# Altium schematic sheet Power.SchDoc: Multiplekser interfejsu SWD
size A4; Organization: Altium Limited; Address1: L3, 12a Rodborough Rd; Adress2: Frenchs Forest; Address3: NSW; Address4: Australia 2086; SheetNumber: 5
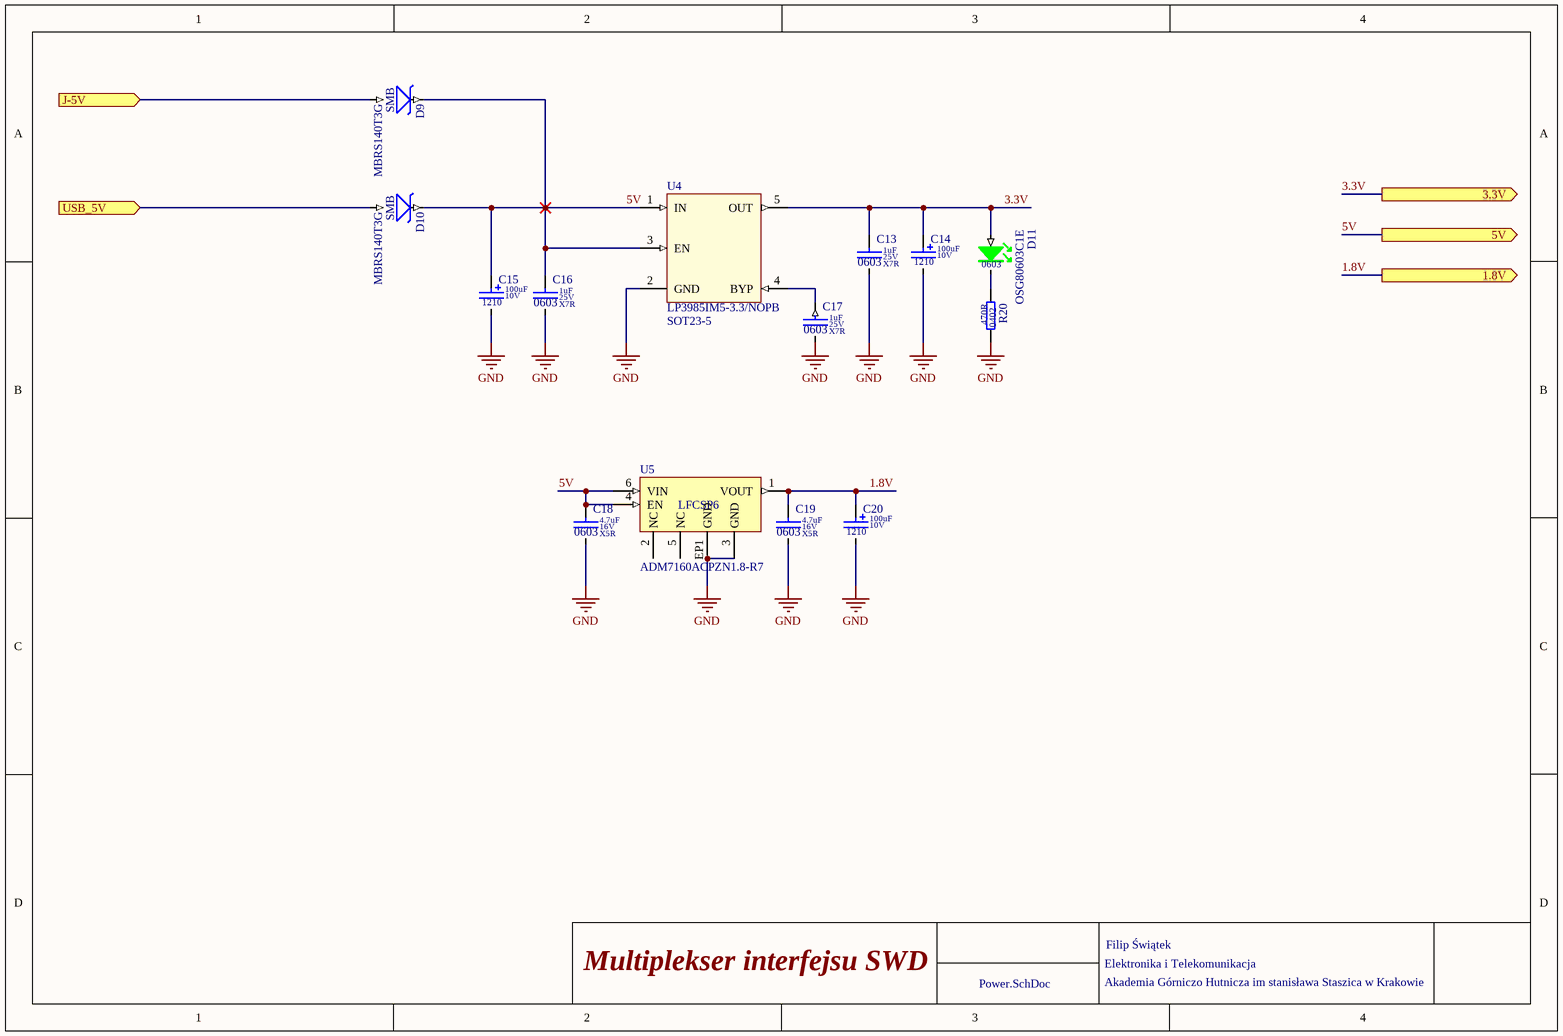
[diagram p0: Power.SchDoc]

## Parts
C13  value 1uF  Dielectric: X7R  Voltage: 25V  SCH_Footprint: 0603  [C_0603_1608]  (hidden comment: Ceramic X7R)
C14  value 100uF  SCH_Footprint: 1210  Voltage: 10V  [CT_1210_3225]  (hidden comment: Tantalum Capacitor)
C15  value 100uF  SCH_Footprint: 1210  Voltage: 10V  [CT_1210_3225]  (hidden comment: Tantalum Capacitor)
C16  value 1uF  Dielectric: X7R  Voltage: 25V  SCH_Footprint: 0603  [C_0603_1608]  (hidden comment: Ceramic X7R)
C17  value 1uF  Dielectric: X7R  Voltage: 25V  SCH_Footprint: 0603  [C_0603_1608]  (hidden comment: Ceramic X7R)
C18  value 4.7uF  Dielectric: X5R  Voltage: 16V  SCH_Footprint: 0603  [C_0603_1608]  (hidden comment: Ceramic X5R)
C19  value 4.7uF  Dielectric: X5R  Voltage: 16V  SCH_Footprint: 0603  [C_0603_1608]  (hidden comment: Ceramic X5R)
C20  value 100uF  SCH_Footprint: 1210  Voltage: 10V  [CT_1210_3225]  (hidden comment: Tantalum Capacitor)
D9  SCH_Footprint: SMB  [SMB_DO-214AA]  (hidden comment: MBRS140T3G)
D10  SCH_Footprint: SMB  [SMB_DO-214AA]  (hidden comment: MBRS140T3G)
D11  value OSG80603C1E  SCH_Footprint: 0603  [OL_0603_1608]  (hidden comment: Green led)
R20  value 470R  SCH_Footprint: 0402  [R_0402_1005]  (hidden comment: Resistor)
U4  value LP3985IM5-3.3/NOPB  SCH_Footprint: SOT23-5  [SOT23-5_SC74A_SOT753_M]  (hidden comment: LP3985IM5-3.3)
U5  value ADM7160ACPZN1.8-R7  SCH_Footprint: LFCSP6  [LFCSP-6-3]  (hidden comment: ADM7160ACPZN1.8-R2)

## Ports
1.8V (out), 3.3V (out), 5V (out), J-5V (in), USB_5V (in)

## Nets
GND: C13.2 C14.2 C15.2 C16.2 C17.2 C18.2 C19.2 C20.2 R20.2 U4.2(GND) U5.3(GND) U5.EP1(GND)
1.8V: C19.1 C20.1 U5.1(VOUT) ; port 1.8V
3.3V: C13.1 C14.1 D11.2(A) U4.5(OUT) ; port 3.3V
5V: C15.1 C16.1 C18.1 D9.1 D10.1 U4.1(IN) U4.3(EN) U5.4(EN) U5.6(VIN) ; port 5V
J-5V: D9.2 ; port J-5V
USB_5V: D10.2 ; port USB_5V
NetC17_1: C17.1 U4.4(BYP)
NetD11_1: D11.1(K) R20.1

Not connected (* = marked no-connect by the designer): U5 2(NC) 5(NC)

## Notes on the sheet
- Elektronika i Telekomunikacja
- Akademia Górniczo Hutnicza im stanisława Staszica w Krakowie
- Filip Świątek

## Library data of the parts
C13 C16 C17 = C_1uF_25V_X7R_0603_10: Capacitor; Manufacturer: Samsung; Manufacturer Part Number: CL10B105KA8NNNC; Tolerance (%): 10; Part Number: C_1uF_25V_X7R_0603_10; HelpURL: http://www.tme.eu/pl/Document/4a42202b32dab16128fe107dd69598cc/samsung-chip-cap.pdf; Supplier 1: TME; Supplier Part Number 1: CL10B105KA8NNNC; Supplier 2: RS Components; Supplier 3: Farnell; Supplier 4: Mouser; Supplier 5: Digi-Key
C14 C15 C20 = CT_100uF_10V_TA2O5_1210_20: Capacitor; Manufacturer: AVX; Manufacturer Part Number: TAJB107M010RNJ; Dielectric: TA2O5; Tolerance (%): 20; Part Number: CT_100uF_10V_TA2O5_1210_20; HelpURL: https://datasheet.octopart.com/TAJB107M010RNJ-AVX-datasheet-12511273.pdf; Supplier 1: TME; Supplier Part Number 1: TAJB107M010R; Supplier 2: RS Components; Supplier Part Number 2: 1360118; Supplier 3: Farnell; Supplier Part Number 3: 1658150; Supplier 4: Mouser; Supplier Part Number 4: 581-TAJB107M010R; Supplier 5: Digi-Key; Supplier Part Number 5: 478-5801-1-ND
C18 C19 = C_4.7uF_16V_X5R_0603_10: Capacitor; Manufacturer: Murata; Manufacturer Part Number: GRM188R61C475KAAJD; Tolerance (%): 10; Part Number: C_4.7uF_16V_X5R_0603_10; HelpURL: https://datasheet.octopart.com/GRM188R61C475KAAJD-Murata-datasheet-66077093.pdf; Supplier 1: TME; Supplier 2: RS Components; Supplier Part Number 2: 884-7264P; Supplier 3: Farnell; Supplier Part Number 3: 2611924; Supplier 4: Mouser; Supplier Part Number 4: 81-GRM188R61C475KAJD; Supplier 5: Digi-Key; Supplier Part Number 5: 490-10481-2-ND
D9 D10 = DS_MBRS140T3G_1A_40V_SMB: Manufacturer: ON Semiconductor; Voltage: 40V; Current: 1A; Value: MBRS140T3G; Part Number: DS_MBRS140T3G_1A_40V_SMB; Manufacturer Part Number: MBRS140T3G; Supplier 1: TME; Supplier 2: RS Components; Supplier 3: Farnell; Supplier 4: Mouser; Supplier 5: Digi-Key; Supplier Part Number 5: MBRS140T3GOSCT-ND
D11 = OL_G_0603_OSG80603C1E: LED GREEN; Manufacturer: Optosupply; Part Number: OL_G_0603_OSG80603C1E; Manufacturer Part Number: OSG80603C1E; Supplier 1: TME; Supplier Part Number 1: OSG80603C1E; Supplier 2: RS Components; Supplier 3: Farnell; Supplier 4: Mouser; Supplier 5: Digi-Key
R20 = R_470R_0402_1: Manufacturer: Yageo; Manufacturer Part Number: RC0402FR-07470RL; Voltage: 50V; Power: 63mW; Tolerance: 1%; Part Number: R_470R_0402_1; HelpURL: http://datasheet.octopart.com/RC0402FR-07470RL-Yageo-datasheet-10408619.pdf; Supplier 1: TME; Supplier Part Number 1: RC0402FR-07470R; Supplier 2: RS Components; Supplier 3: Farnell; Supplier Part Number 3: 9239197; Supplier 4: Mouser; Supplier Part Number 4: 603-RC0402FR-07470RL; Supplier 5: Digi-Key; Supplier Part Number 5: 311-470LRCT-ND
U4 = VL_LP3985IM5-3.3: Manufacturer: Texas Instruments; Voltage: 3V3; Current: 0A15; Part Number: VL_LP3985IM5-3.3; HelpURL: http://www.ti.com/lit/ds/symlink/lp3985.pdf; Manufacturer Part Number: LP3985IM5-3.3/NOPB; Supplier 1: TME; Supplier Part Number 1: LP3985IM5-3.3; Supplier 2: RS Components; Supplier Part Number 2: 102-5736; Supplier 3: Farnell; Supplier Part Number 3: 1469025; Supplier 4: Mouser; Supplier Part Number 4: 926-3985IM5-3.3/NOPB; Supplier 5: Digi-Key; Supplier Part Number 5: LP3985IM5-3.3/NOPBCT-ND
U5 = VL_ADM7160ACPZN1.8-R7: Manufacturer: Analog Devices; Voltage: 1V8; Current: 0A2; Part Number: VL_ADM7160ACPZN1.8-R7; HelpURL: http://datasheet.octopart.com/ADM7160ACPZN1.8-R2-Analog-Devices-datasheet-26822004.pdf; Manufacturer Part Number: ADM7160ACPZN1.8-R7; Supplier 1: TME; Supplier 2: RS Components; Supplier 3: Farnell; Supplier 4: Mouser; Supplier Part Number 4: 584-DM7160ACPZN1.8R7; Supplier 5: Digi-Key; Supplier Part Number 5: ADM7160ACPZN1.8-R7CT-ND